# Altium project Ocore.PrjPcb
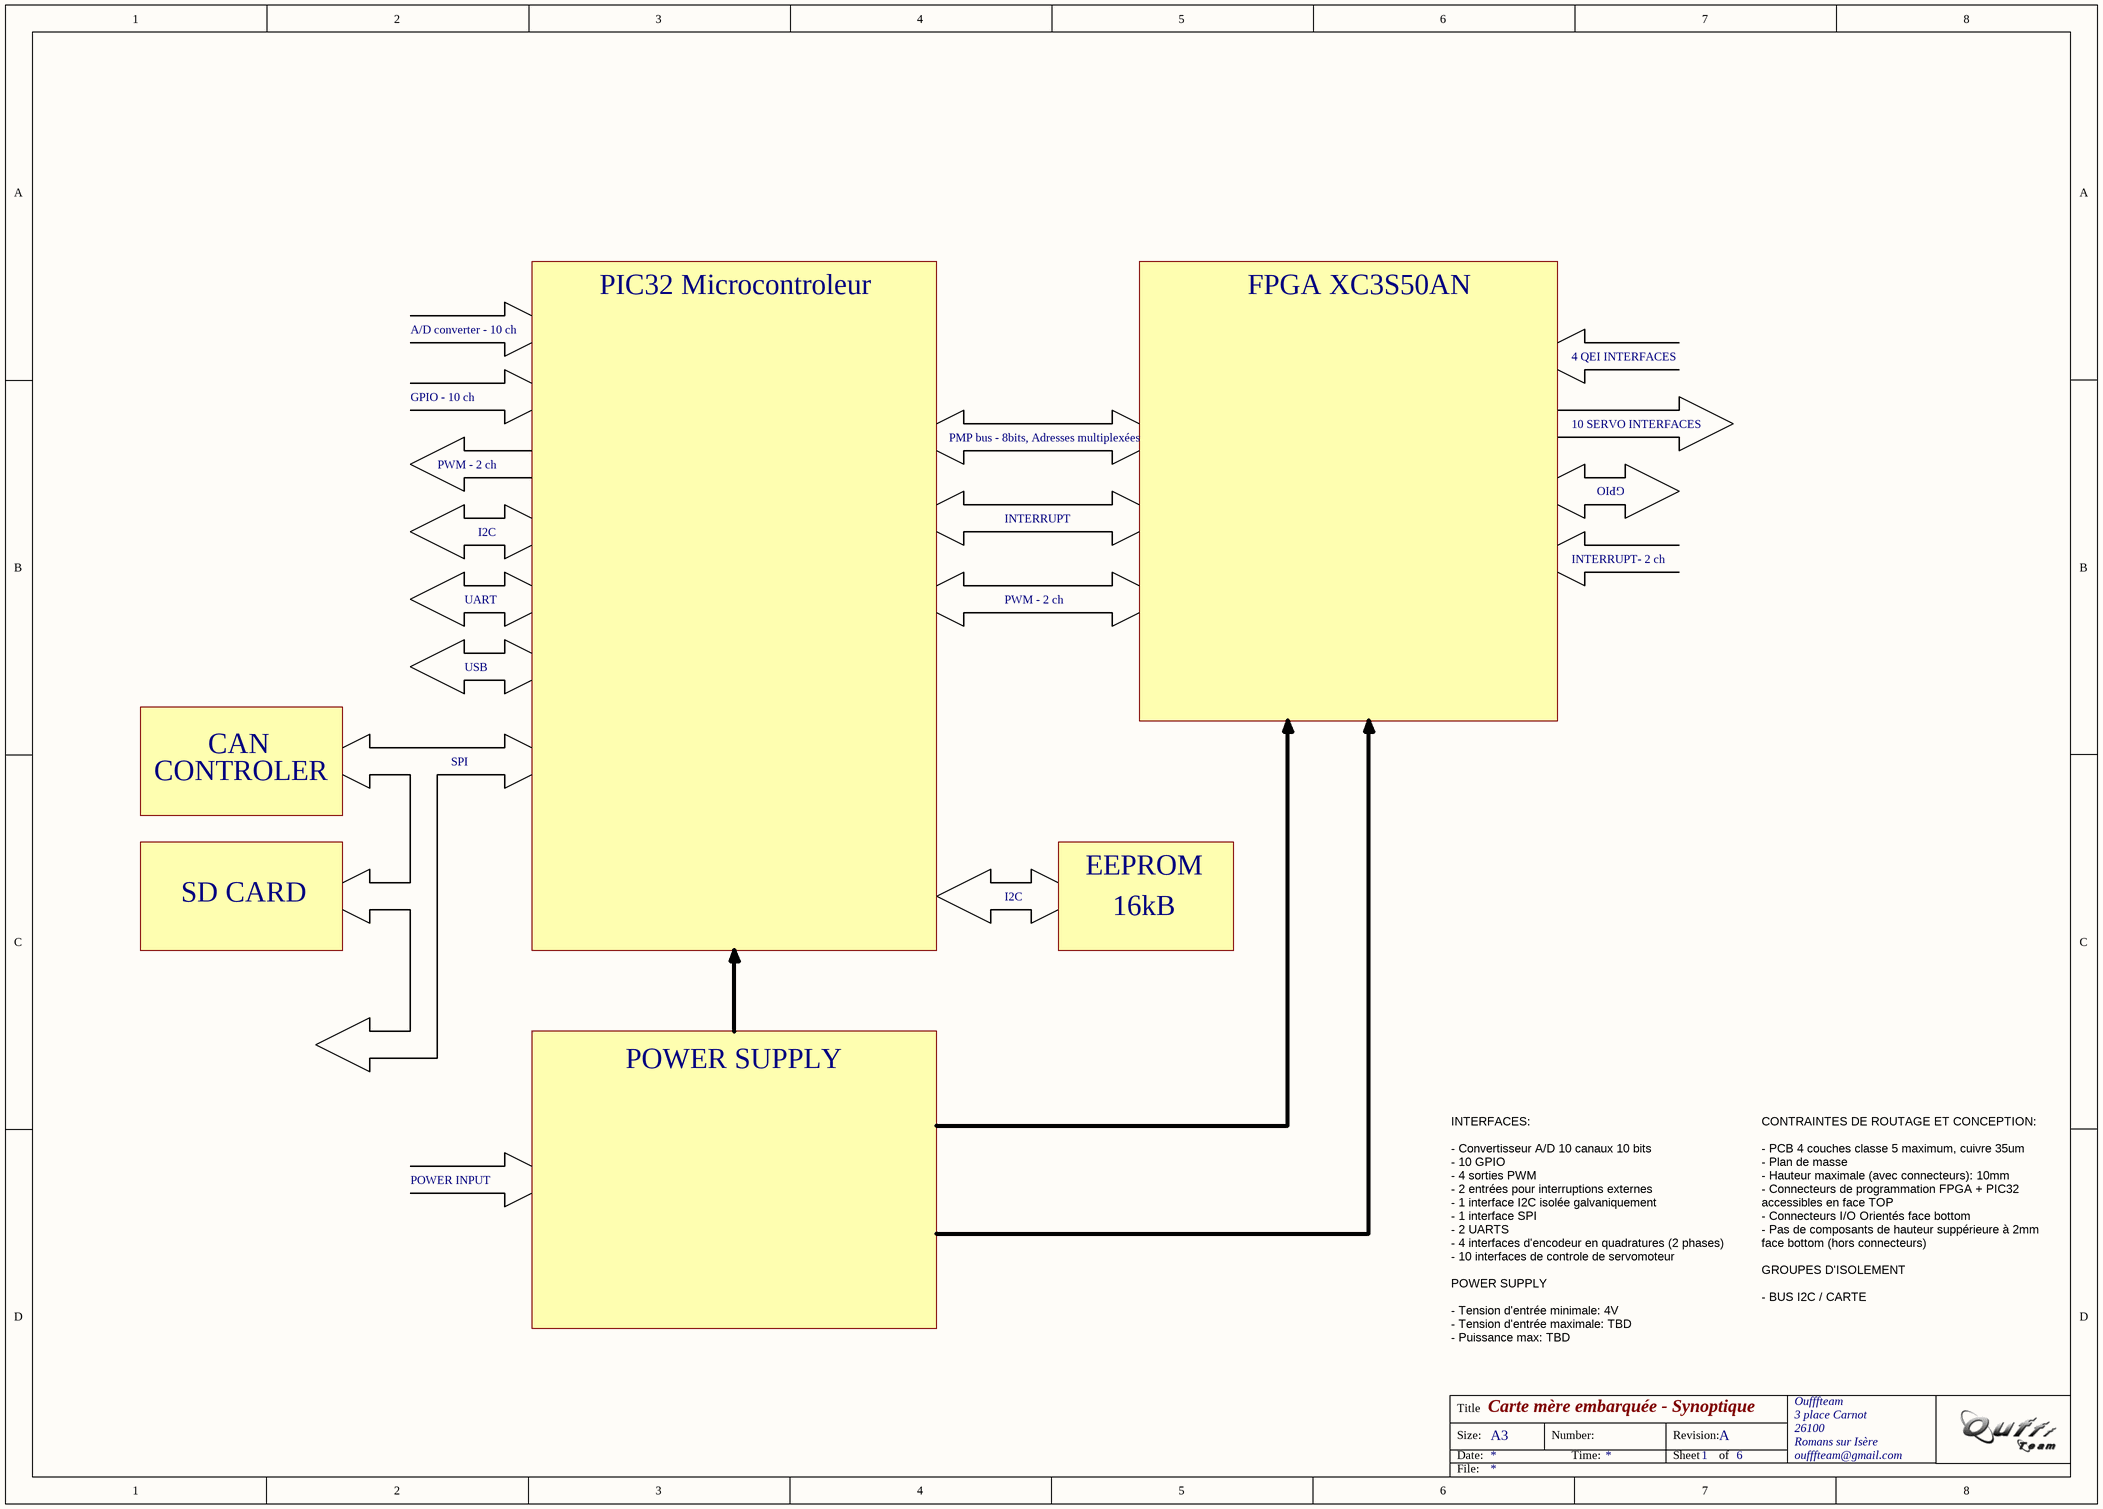
[diagram p0: SYNOPTIQUE.SchDoc]
4 sheets, 90 parts. Net scope: global (net labels, ports and power ports of the same name join across sheets).
Board files: o_core_v1.PcbDoc, o_core_v2.PcbDoc, o_core_v3.PcbDoc
Sheets:
  SYNOPTIQUE.SchDoc
  CONNECTS.SchDoc
  FPGA.SchDoc
  POWER_SUPPLY.SchDoc

## Sheet SYNOPTIQUE.SchDoc: Carte mère embarquée - Synoptique
size A3; Author: B Labbe; CompanyName: Ouffteam; DrawnBy: B Labbe; Engineer: B Labbe; Organization: Ouffteam; Address1: L3, 12a Rodborough Rd; Address2: Frenchs Forest; Address3: NSW; Address4: Australia 2086; Revision: A; SheetNumber: 1; SheetTotal: 6; DocumentName: Carte mère embarquée - Synoptique

### Notes on the sheet
- PIC32 Microcontroleur
- FPGA XC3S50AN
- A/D converter - 10 ch
- 4 QEI INTERFACES
- GPIO - 10 ch
- PMP bus - 8bits, Adresses multiplexées
- 10 SERVO INTERFACES
- PWM - 2 ch
- INTERRUPT
- GPIO
- I2C
- INTERRUPT- 2 ch
- UART
- USB
- CONTROLER
- CAN
- SPI
- SD CARD
- EEPROM
- 16kB
- POWER SUPPLY
- POWER INPUT
- INTERFACES:
  - Convertisseur A/D 10 canaux 10 bits
  - 10 GPIO
  - 4 sorties PWM
  - 2 entrées pour interruptions externes
  - 1 interface I2C isolée galvaniquement
  - 1 interface SPI
  - 2 UARTS
  - 4 interfaces d'encodeur en quadratures (2 phases)
  - 10 interfaces de controle de servomoteur
  POWER SUPPLY
  - Tension d'entrée minimale: 4V
  - Tension d'entrée maximale: TBD
  - Puissance max: TBD
- CONTRAINTES DE ROUTAGE ET CONCEPTION:
  - PCB 4 couches classe 5 maximum, cuivre 35um
  - Plan de masse
  - Hauteur maximale (avec connecteurs): 10mm
  - Connecteurs de programmation FPGA + PIC32 accessibles en face TOP
  - Connecteurs I/O Orientés face bottom
  - Pas de composants de hauteur suppérieure à 2mm face bottom (hors connecteurs)
  GROUPES D'ISOLEMENT
  - BUS I2C / CARTE
- Title
- Size:
- Date:
- A3
- Number:
- Time:
- Revision:
- Sheet
- of
- Oufffteam
- 3 place Carnot
- 26100
- Romans sur Isère
- oufffteam@gmail.com
- File:

## Sheet CONNECTS.SchDoc: Carte mère embarquée - Ports
size A3; Author: B.Labbe; CompanyName: Oufffteam; DrawnBy: B.Labbe; Engineer: B.Labbe; Organization: Oufffteam; Revision: A; SheetNumber: 2; SheetTotal: 6; DocumentName: Carte mère embarquée - Ports
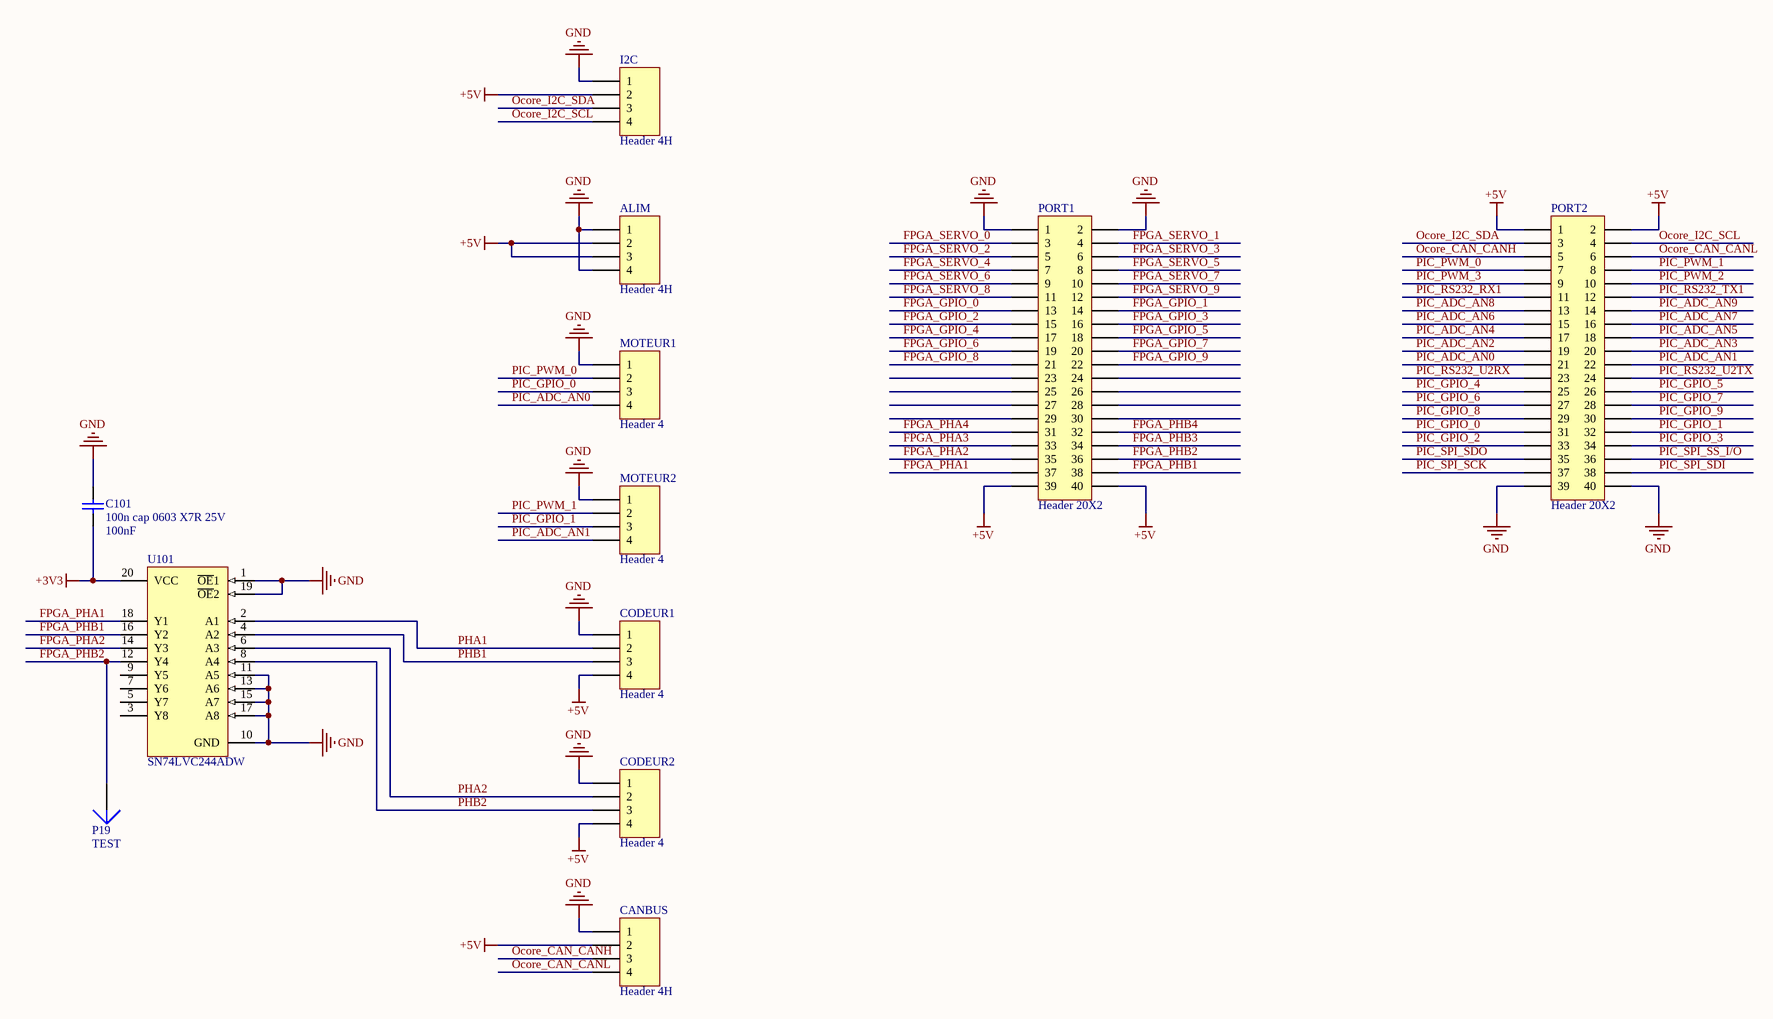
[diagram p1: CONNECTS.SchDoc]

### Parts
ALIM  Header 4H  [HDR1X4H]
C101  100n cap 0603 X7R 25V  value 100nF  [1608[0603]]  (graphical)
CANBUS  Header 4H  [HDR1X4H]
CODEUR1  Header 4  [HDR1X4]  (graphical)
CODEUR2  Header 4  [HDR1X4]  (graphical)
I2C  Header 4H  [HDR1X4H]
MOTEUR1  Header 4  [HDR1X4]  (graphical)
MOTEUR2  Header 4  [HDR1X4]  (graphical)
P19  TEST  [TP1]  (graphical)
PORT1  Header 20X2  [HDR2X20]
PORT2  Header 20X2  [HDR2X20]
U101  SN74LVC244ADW  [DW020_N]  (graphical)

### Nets
+3V3: C101.1 U101.20(VCC)
+5V: ALIM.2 ALIM.3 CANBUS.2 CODEUR1.4 CODEUR2.4 I2C.2 PORT1.39 PORT1.40 PORT2.1 PORT2.2
GND: ALIM.1 ALIM.4 C101.2 CANBUS.1 CODEUR1.1 CODEUR2.1 I2C.1 MOTEUR1.1 MOTEUR2.1 PORT1.1 PORT1.2 PORT2.39 PORT2.40 U101.1(~{OE}1) U101.10(GND) U101.11(A5) U101.13(A6) U101.15(A7) U101.17(A8) U101.19(~{OE}2)
FPGA_GPIO_0: PORT1.13
FPGA_GPIO_1: PORT1.14
FPGA_GPIO_2: PORT1.15
FPGA_GPIO_3: PORT1.16
FPGA_GPIO_4: PORT1.17
FPGA_GPIO_5: PORT1.18
FPGA_GPIO_6: PORT1.19
FPGA_GPIO_7: PORT1.20
FPGA_GPIO_8: PORT1.21
FPGA_GPIO_9: PORT1.22
FPGA_PHA1: PORT1.37 U101.18(Y1)
FPGA_PHA2: PORT1.35 U101.14(Y3)
FPGA_PHA3: PORT1.33
FPGA_PHA4: PORT1.31
FPGA_PHB1: PORT1.38 U101.16(Y2)
FPGA_PHB2: P19.1 PORT1.36 U101.12(Y4)
FPGA_PHB3: PORT1.34
FPGA_PHB4: PORT1.32
FPGA_SERVO_0: PORT1.3
FPGA_SERVO_1: PORT1.4
FPGA_SERVO_2: PORT1.5
FPGA_SERVO_3: PORT1.6
FPGA_SERVO_4: PORT1.7
FPGA_SERVO_5: PORT1.8
FPGA_SERVO_6: PORT1.9
FPGA_SERVO_7: PORT1.10
FPGA_SERVO_8: PORT1.11
FPGA_SERVO_9: PORT1.12
Ocore_CAN_CANH: CANBUS.3 PORT2.5
Ocore_CAN_CANL: CANBUS.4 PORT2.6
Ocore_I2C_SCL: I2C.4 PORT2.4
Ocore_I2C_SDA: I2C.3 PORT2.3
PHA1: CODEUR1.2 U101.2(A1)
PHA2: CODEUR2.2 U101.6(A3)
PHB1: CODEUR1.3 U101.4(A2)
PHB2: CODEUR2.3 U101.8(A4)
PIC_ADC_AN0: MOTEUR1.4 PORT2.21
PIC_ADC_AN1: MOTEUR2.4 PORT2.22
PIC_ADC_AN2: PORT2.19
PIC_ADC_AN3: PORT2.20
PIC_ADC_AN4: PORT2.17
PIC_ADC_AN5: PORT2.18
PIC_ADC_AN6: PORT2.15
PIC_ADC_AN7: PORT2.16
PIC_ADC_AN8: PORT2.13
PIC_ADC_AN9: PORT2.14
PIC_GPIO_0: MOTEUR1.3 PORT2.31
PIC_GPIO_1: MOTEUR2.3 PORT2.32
PIC_GPIO_2: PORT2.33
PIC_GPIO_3: PORT2.34
PIC_GPIO_4: PORT2.25
PIC_GPIO_5: PORT2.26
PIC_GPIO_6: PORT2.27
PIC_GPIO_7: PORT2.28
PIC_GPIO_8: PORT2.29
PIC_GPIO_9: PORT2.30
PIC_PWM_0: MOTEUR1.2 PORT2.7
PIC_PWM_1: MOTEUR2.2 PORT2.8
PIC_PWM_2: PORT2.10
PIC_PWM_3: PORT2.9
PIC_RS232_RX1: PORT2.11
PIC_RS232_TX1: PORT2.12
PIC_RS232_U2RX: PORT2.23
PIC_RS232_U2TX: PORT2.24
PIC_SPI_SCK: PORT2.37
PIC_SPI_SDI: PORT2.38
PIC_SPI_SDO: PORT2.35
PIC_SPI_SS_I/O: PORT2.36

Not connected (* = marked no-connect by the designer): PORT1 23 24 25 26 27 28 29 30; U101 3(Y8) 5(Y7) 7(Y6) 9(Y5)

### Notes on the sheet
- Title
- Size:
- Date:
- A3
- Number:
- Time:
- Revision:
- Sheet
- of
- Oufffteam
- 3 place Carnot
- 26100
- Romans sur Isère
- oufffteam@gmail.com
- File:

### Library data of the parts
ALIM CANBUS I2C = Header 4H: Header, 4-Pin, Right Angle; LatestRevisionDate: 17-Jul-2002; LatestRevisionNote: Re-released for DXP Platform.; Publisher: Altium Limited
C101 = Cap: Capacitor; Published: 8-Jun-2000; LatestRevisionDate: 17-Jul-2002; LatestRevisionNote: Re-released for DXP Platform.; PackageReference: RAD-0.3; Publisher: Altium Limited
CODEUR1 CODEUR2 MOTEUR1 MOTEUR2 = Header 4: Header, 4-Pin; LatestRevisionDate: 17-Jul-2002; LatestRevisionNote: Re-released for DXP Platform.; Publisher: Altium Limited
P19 = Plug: LatestRevisionDate: 17-Jul-2002; LatestRevisionNote: Re-released for DXP Platform.; Publisher: Altium Limited
PORT1 PORT2 = Header 20X2: Header, 20-Pin, Dual row; LatestRevisionDate: 17-Jul-2002; LatestRevisionNote: Re-released for DXP Platform.; Publisher: Altium Limited
U101 = SN74LVC244ADW: Octal Buffer/Driver with 3-State Outputs; Published: 8-Jun-2000; LatestRevisionDate: 13-Apr-2006; LatestRevisionNote: IPC-7351 Footprint Added.; DatasheetVersion: Apr-1999; PackageVersion: Mar-2000; PackageReference: DW020; Publisher: Altium Limited; PackageDescription: 20-Pin Plastic Small Outline Integrated Circuit 1.27 mm Pitch; Code_JEDEC: MS-013; Code_IPC: SOIC127P1030-20; ComponentLink1Description: Manufacturer Link; ComponentLink1URL: http://www.ti.com/; ComponentLink2Description: Datasheet; ComponentLink2URL: http://www-s.ti.com/sc/ds/sn74lvc244a.pdf

## Sheet FPGA.SchDoc: Carte mère embarquée - CPLD
size A3; Author: B Labbe; CompanyName: Oufffteam; DrawnBy: B Labbe; Engineer: B Labbe; Organization: Oufffteam; Address1: L3, 12a Rodborough Rd; Address2: Frenchs Forest; Address3: NSW; Address4: Australia 2086; Revision: A; SheetNumber: 4; SheetTotal: 6; DocumentName: Carte mère embarquée - CPLD
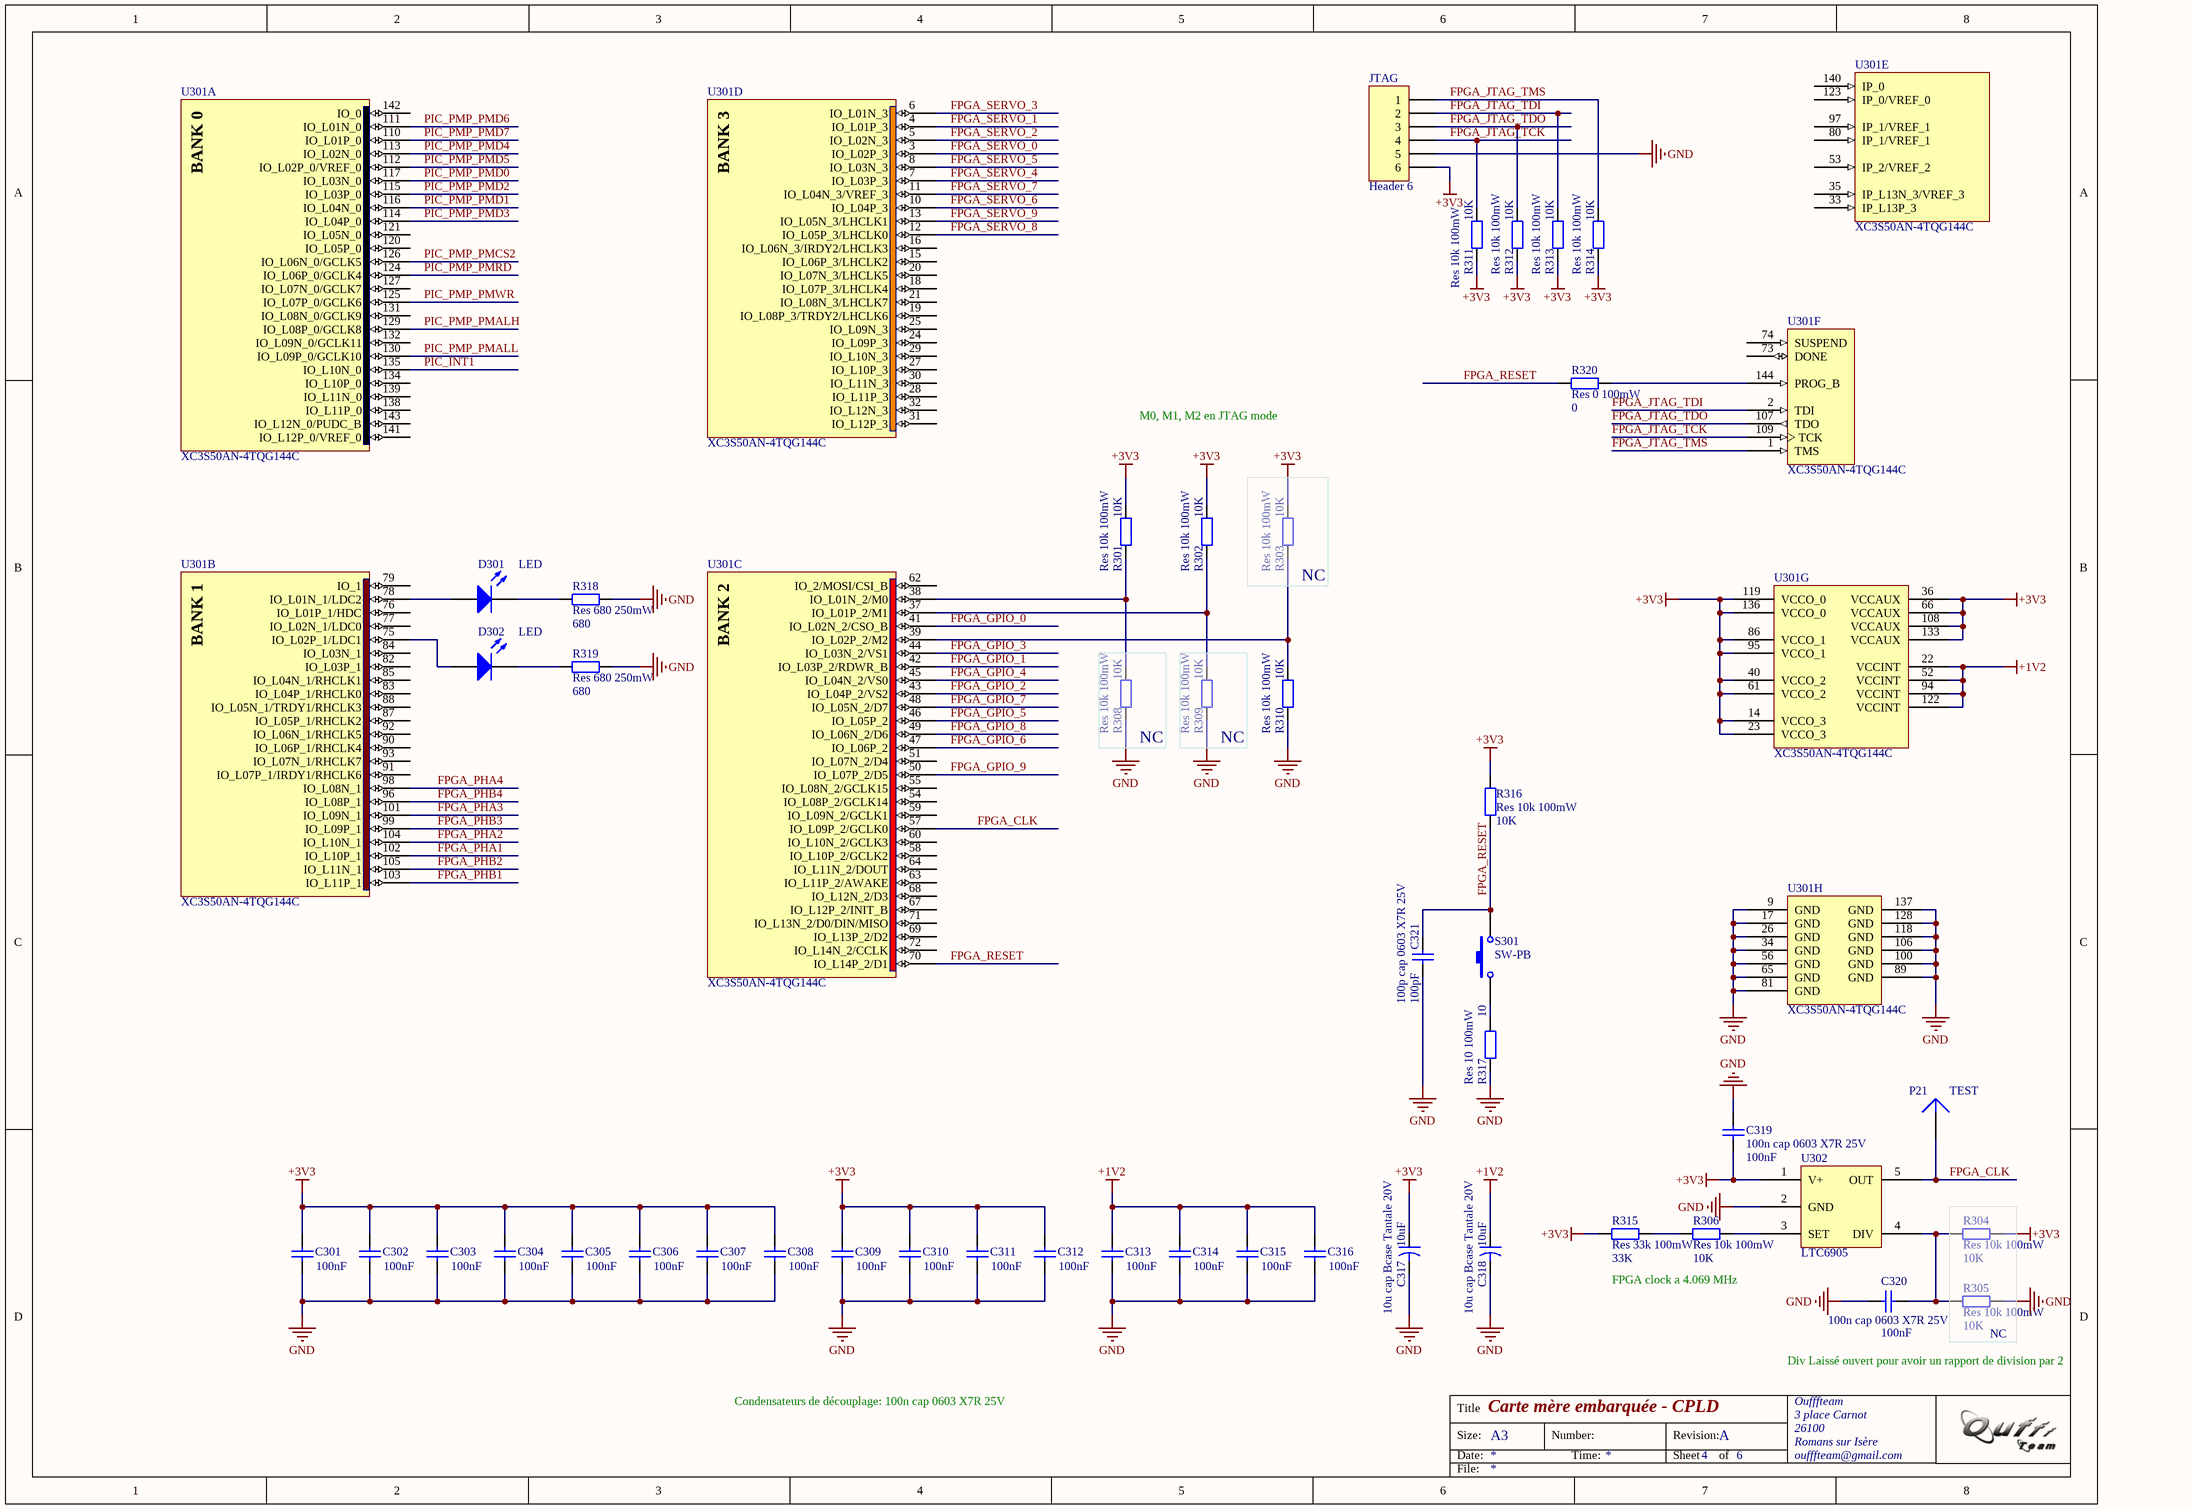
[diagram p2: FPGA.SchDoc]

### Parts
C301  value 100nF  [1608[0603]]  (hidden comment: 100n cap 0603 X7R 25V)
C302  value 100nF  [1608[0603]]  (hidden comment: 100n cap 0603 X7R 25V)
C303  value 100nF  [1608[0603]]  (hidden comment: 100n cap 0603 X7R 25V)
C304  value 100nF  [1608[0603]]  (hidden comment: 100n cap 0603 X7R 25V)
C305  value 100nF  [1608[0603]]  (hidden comment: 100n cap 0603 X7R 25V)
C306  value 100nF  [1608[0603]]  (hidden comment: 100n cap 0603 X7R 25V)
C307  value 100nF  [1608[0603]]  (hidden comment: 100n cap 0603 X7R 25V)
C308  value 100nF  [1608[0603]]  (hidden comment: 100n cap 0603 X7R 25V)
C309  value 100nF  [1608[0603]]  (hidden comment: 100n cap 0603 X7R 25V)
C310  value 100nF  [1608[0603]]  (hidden comment: 100n cap 0603 X7R 25V)
C311  value 100nF  [1608[0603]]  (hidden comment: 100n cap 0603 X7R 25V)
C312  value 100nF  [1608[0603]]  (hidden comment: 100n cap 0603 X7R 25V)
C313  value 100nF  [1608[0603]]  (hidden comment: 100n cap 0603 X7R 25V)
C314  value 100nF  [1608[0603]]  (hidden comment: 100n cap 0603 X7R 25V)
C315  value 100nF  [1608[0603]]  (hidden comment: 100n cap 0603 X7R 25V)
C316  value 100nF  [1608[0603]]  (hidden comment: 100n cap 0603 X7R 25V)
C317  10u cap Bcase Tantale 20V  value 10uF  [6032]
C318  10u cap Bcase Tantale 20V  value 10uF  [6032]
C319  100n cap 0603 X7R 25V  value 100nF  [1608[0603]]
C320  100n cap 0603 X7R 25V  value 100nF  [1608[0603]]
C321  100p cap 0603 X7R 25V  value 100pF  [1608[0603]]
D301  LED  [1608[0603]]
D302  LED  [1608[0603]]
JTAG  Header 6  [HDR1X6]
P21  TEST  [TP1]
R301  Res 10k 100mW  value 10K  [1608[0603]]
R302  Res 10k 100mW  value 10K  [1608[0603]]
R303  Res 10k 100mW  value 10K  [1608[0603]]
R304  Res 10k 100mW  value 10K  [1608[0603]]
R305  Res 10k 100mW  value 10K  [1608[0603]]
R306  Res 10k 100mW  value 10K  [1608[0603]]
R308  Res 10k 100mW  value 10K  [1608[0603]]
R309  Res 10k 100mW  value 10K  [1608[0603]]
R310  Res 10k 100mW  value 10K  [1608[0603]]
R311  Res 10k 100mW  value 10K  [1608[0603]]
R312  Res 10k 100mW  value 10K  [1608[0603]]
R313  Res 10k 100mW  value 10K  [1608[0603]]
R314  Res 10k 100mW  value 10K  [1608[0603]]
R315  Res 33k 100mW  value 33K  [1608[0603]]
R316  Res 10k 100mW  value 10K  [1608[0603]]
R317  Res 10 100mW  value 10  [1608[0603]]
R318  Res 680 250mW  value 680  [1608[0603]]
R319  Res 680 250mW  value 680  [1608[0603]]
R320  Res 0 100mW  value 0  [1608[0603]]
S301  SW-PB  [BP1]
U301  XC3S50AN-4TQG144C  [TQG144_N]  (parts A,B,C,D,E,F,G,H of 8)
U302  LTC6905  [S5]

### Blocks framed on the sheet
NC: R303
NC: R308
NC: R309
NC: R304 R305

### Nets
+1V2: C313.2 C314.2 C315.2 C316.2 C318.1 U301.22(VCCINT) U301.52(VCCINT) U301.94(VCCINT) U301.122(VCCINT)
+3V3: C301.2 C302.2 C303.2 C304.2 C305.2 C306.2 C307.2 C308.2 C309.2 C310.2 C311.2 C312.2 C317.1 C319.1 JTAG.6 R301.2 R302.2 R303.2 R304.2 R311.1 R312.1 R313.1 R314.1 R315.1 R316.2 U301.14(VCCO_3) U301.23(VCCO_3) U301.36(VCCAUX) U301.40(VCCO_2) U301.61(VCCO_2) U301.66(VCCAUX) U301.86(VCCO_1) U301.95(VCCO_1) U301.108(VCCAUX) U301.119(VCCO_0) U301.133(VCCAUX) U301.136(VCCO_0) U302.1(V+)
GND: C301.1 C302.1 C303.1 C304.1 C305.1 C306.1 C307.1 C308.1 C309.1 C310.1 C311.1 C312.1 C313.1 C314.1 C315.1 C316.1 C317.2 C318.2 C319.2 C320.1 C321.1 JTAG.5 R305.2 R308.1 R309.1 R310.1 R317.1 R318.2 R319.2 U301.9(GND) U301.17(GND) U301.26(GND) U301.34(GND) U301.56(GND) U301.65(GND) U301.81(GND) U301.89(GND) U301.100(GND) U301.106(GND) U301.118(GND) U301.128(GND) U301.137(GND) U302.2(GND)
FPGA_CLK: P21.1 U301.57(IO_L09P_2/GCLK0) U302.5(OUT)
FPGA_GPIO_0: U301.41(IO_L02N_2/CSO_B)
FPGA_GPIO_1: U301.42(IO_L03P_2/RDWR_B)
FPGA_GPIO_2: U301.43(IO_L04P_2/VS2)
FPGA_GPIO_3: U301.44(IO_L03N_2/VS1)
FPGA_GPIO_4: U301.45(IO_L04N_2/VS0)
FPGA_GPIO_5: U301.46(IO_L05P_2)
FPGA_GPIO_6: U301.47(IO_L06P_2)
FPGA_GPIO_7: U301.48(IO_L05N_2/D7)
FPGA_GPIO_8: U301.49(IO_L06N_2/D6)
FPGA_GPIO_9: U301.50(IO_L07P_2/D5)
FPGA_JTAG_TCK: JTAG.4 R311.2 U301.109(TCK)
FPGA_JTAG_TDI: JTAG.2 R313.2 U301.2(TDI)
FPGA_JTAG_TDO: JTAG.3 R312.2 U301.107(TDO)
FPGA_JTAG_TMS: JTAG.1 R314.2 U301.1(TMS)
FPGA_PHA1: U301.102(IO_L10P_1)
FPGA_PHA2: U301.104(IO_L10N_1)
FPGA_PHA3: U301.101(IO_L09N_1)
FPGA_PHA4: U301.98(IO_L08N_1)
FPGA_PHB1: U301.103(IO_L11P_1)
FPGA_PHB2: U301.105(IO_L11N_1)
FPGA_PHB3: U301.99(IO_L09P_1)
FPGA_PHB4: U301.96(IO_L08P_1)
FPGA_RESET: C321.2 R316.1 R320.1 S301.3 U301.70(IO_L14P_2/D1)
FPGA_SERVO_0: U301.3(IO_L02P_3)
FPGA_SERVO_1: U301.4(IO_L01P_3)
FPGA_SERVO_2: U301.5(IO_L02N_3)
FPGA_SERVO_3: U301.6(IO_L01N_3)
FPGA_SERVO_4: U301.7(IO_L03P_3)
FPGA_SERVO_5: U301.8(IO_L03N_3)
FPGA_SERVO_6: U301.10(IO_L04P_3)
FPGA_SERVO_7: U301.11(IO_L04N_3/VREF_3)
FPGA_SERVO_8: U301.12(IO_L05P_3/LHCLK0)
FPGA_SERVO_9: U301.13(IO_L05N_3/LHCLK1)
PIC_INT1: U301.135(IO_L10N_0)
PIC_PMP_PMALH: U301.129(IO_L08P_0/GCLK8)
PIC_PMP_PMALL: U301.130(IO_L09P_0/GCLK10)
PIC_PMP_PMCS2: U301.126(IO_L06N_0/GCLK5)
PIC_PMP_PMD0: U301.117(IO_L03N_0)
PIC_PMP_PMD1: U301.116(IO_L04N_0)
PIC_PMP_PMD2: U301.115(IO_L03P_0)
PIC_PMP_PMD3: U301.114(IO_L04P_0)
PIC_PMP_PMD4: U301.113(IO_L02N_0)
PIC_PMP_PMD5: U301.112(IO_L02P_0/VREF_0)
PIC_PMP_PMD6: U301.111(IO_L01N_0)
PIC_PMP_PMD7: U301.110(IO_L01P_0)
PIC_PMP_PMRD: U301.124(IO_L06P_0/GCLK4)
PIC_PMP_PMWR: U301.125(IO_L07P_0/GCLK6)
NetC320_2: C320.2 R304.1 R305.1 U302.4(DIV)
NetD301_1: D301.1(A) U301.78(IO_L01N_1/LDC2)
NetD301_2: D301.2(K) R318.1
NetD302_1: D302.1(A) U301.75(IO_L02P_1/LDC1)
NetD302_2: D302.2(K) R319.1
NetR301_1: R301.1 R308.2 U301.38(IO_L01N_2/M0)
NetR302_1: R302.1 R309.2 U301.37(IO_L01P_2/M1)
NetR303_1: R303.1 R310.2 U301.39(IO_L02P_2/M2)
NetR306_1: R306.1 R315.2
NetR306_2: R306.2 U302.3(SET)
NetR317_2: R317.2 S301.1
NetR320_2: R320.2 U301.144(PROG_B)

Not connected (* = marked no-connect by the designer): U301 15(IO_L06P_3/LHCLK2) 16(IO_L06N_3/IRDY2/LHCLK3) 18(IO_L07P_3/LHCLK4) 19(IO_L08P_3/TRDY2/LHCLK6) 20(IO_L07N_3/LHCLK5) 21(IO_L08N_3/LHCLK7) 24(IO_L09P_3) 25(IO_L09N_3) 27(IO_L10P_3) 28(IO_L11P_3) 29(IO_L10N_3) 30(IO_L11N_3) 31(IO_L12P_3) 32(IO_L12N_3) 33(IP_L13P_3) 35(IP_L13N_3/VREF_3) 51(IO_L07N_2/D4) 53(IP_2/VREF_2) 54(IO_L08P_2/GCLK14) 55(IO_L08N_2/GCLK15) 58(IO_L10P_2/GCLK2) 59(IO_L09N_2/GCLK1) 60(IO_L10N_2/GCLK3) 62(IO_2/MOSI/CSI_B) 63(IO_L11P_2/AWAKE) 64(IO_L11N_2/DOUT) 67(IO_L12P_2/INIT_B) 68(IO_L12N_2/D3) 69(IO_L13P_2/D2) 71(IO_L13N_2/D0/DIN/MISO) 72(IO_L14N_2/CCLK) 73(DONE) 74(SUSPEND) 76(IO_L01P_1/HDC) 77(IO_L02N_1/LDC0) 79(IO_1) 80(IP_1/VREF_1) 82(IO_L03P_1) 83(IO_L04P_1/RHCLK0) 84(IO_L03N_1) 85(IO_L04N_1/RHCLK1) 87(IO_L05P_1/RHCLK2) 88(IO_L05N_1/TRDY1/RHCLK3) 90(IO_L06P_1/RHCLK4) 91(IO_L07P_1/IRDY1/RHCLK6) 92(IO_L06N_1/RHCLK5) 93(IO_L07N_1/RHCLK7) 97(IP_1/VREF_1) 120(IO_L05P_0) 121(IO_L05N_0) 123(IP_0/VREF_0) 127(IO_L07N_0/GCLK7) 131(IO_L08N_0/GCLK9) 132(IO_L09N_0/GCLK11) 134(IO_L10P_0) 138(IO_L11P_0) 139(IO_L11N_0) 140(IP_0) 141(IO_L12P_0/VREF_0) 142(IO_0) 143(IO_L12N_0/PUDC_B)

### Notes on the sheet
- M0, M1, M2 en JTAG mode
- FPGA clock a 4.069 MHz
- Div Laissé ouvert pour avoir un rapport de division par 2
- Condensateurs de découplage: 100n cap 0603 X7R 25V
- Title
- Size:
- Date:
- A3
- Number:
- Time:
- Revision:
- Sheet
- of
- Oufffteam
- 3 place Carnot
- 26100
- Romans sur Isère
- oufffteam@gmail.com
- File:
- (in symbol XC3S50AN-4TQG144C, part A) BANK 0
- (in symbol XC3S50AN-4TQG144C, part B) BANK 1
- (in symbol XC3S50AN-4TQG144C, part C) BANK 2
- (in symbol XC3S50AN-4TQG144C, part D) BANK 3

### Library data of the parts
C301-C316 C319-C321 = Cap: Capacitor; Published: 8-Jun-2000; LatestRevisionDate: 17-Jul-2002; LatestRevisionNote: Re-released for DXP Platform.; PackageReference: RAD-0.3; Publisher: Altium Limited
C317 C318 = Cap2: Capacitor; Published: 23-Sep-2002; PackageReference: CAPR5-4X5; Publisher: Altium Limited
D301 D302 = LED0: LED SML-311DTT86; Published: 8-Jun-2000; LatestRevisionDate: 08-Jul-2005; LatestRevisionNote: Mech Layer 1 removed.; PackageReference: LED-0; Publisher: Altium Limited
JTAG = Header 6: Header, 6-Pin; LatestRevisionDate: 17-Jul-2002; LatestRevisionNote: Re-released for DXP Platform.; Publisher: Altium Limited
P21 = Plug: LatestRevisionDate: 17-Jul-2002; LatestRevisionNote: Re-released for DXP Platform.; Publisher: Altium Limited
R301-R306 R308-R320 = Res2: Resistor; Published: 8-Jun-2000; LatestRevisionDate: 17-Jul-2002; LatestRevisionNote: Re-released for DXP Platform.; PackageReference: AXIAL-0.4; Publisher: Altium Limited
S301 = SW-PB: Switch; Published: 24-Mar-1999; LatestRevisionDate: 17-Jul-2002; LatestRevisionNote: Re-released for DXP Platform.; PackageReference: SPST-2; Publisher: Altium Limited
U301 = XC3S50AN-4TQG144C: Spartan-3AN Non-Volatile FPGA, 108 User I/Os, 144-Pin TQFP, Standard Performance, Commercial Grade, Pb-Free; Published: 20-Jul-2007; DatasheetVersion: 26-Feb-2007; PackageVersion: ver1.2, Jun-2004; PackageReference: TQG144; Publisher: Altium Limited; PackageDescription: 144-Pin Thin Quad Flat Pack (TQG144) - Pb-Free; Code_JEDEC: MS-026-BFB; ComponentLink1Description: Manufacturer Link; ComponentLink1URL: http://www.xilinx.com/products/silicon_solutions/fpgas/spartan_series/spartan3an_fpgas/index.htm; ComponentLink2Description: Datasheet; ComponentLink2URL: http://direct.xilinx.com/bvdocs/publications/ds557.pdf
U302 = LTC6905: 17MHz to 170MHz Resistor Set SOT-23 Oscillator

## Sheet POWER_SUPPLY.SchDoc: Carte mère embarquée - Power Supply
size A3; Author: B Labbe; CompanyName: Oufffteam; DrawnBy: B Labbe; Engineer: B Labbe; Organization: Oufffteam; Address1: L3, 12a Rodborough Rd; Address2: Frenchs Forest; Address3: NSW; Address4: Australia 2086; Revision: A; SheetNumber: 5; SheetTotal: 6; DocumentName: Carte mère embarquée - Power Supply
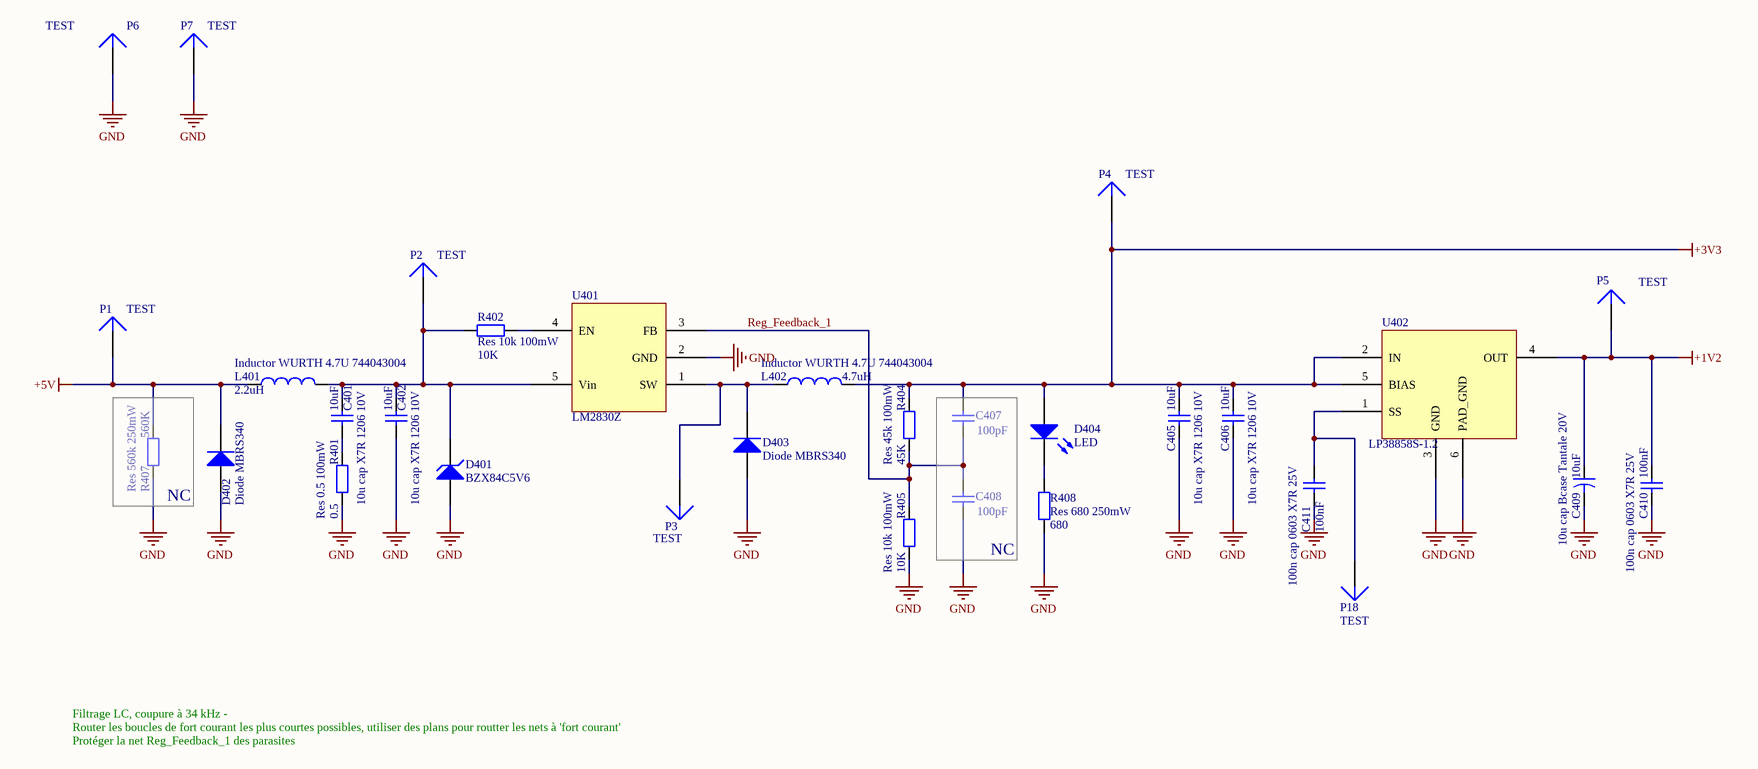
[diagram p3: POWER_SUPPLY.SchDoc]

### Parts
C401  10u cap X7R 1206 10V  value 10uF  [3216[1206]]
C402  10u cap X7R 1206 10V  value 10uF  [3216[1206]]
C405  10u cap X7R 1206 10V  value 10uF  [3216[1206]]
C406  10u cap X7R 1206 10V  value 10uF  [3216[1206]]
C407  value 100pF  [1608[0603]]  (hidden comment: 100p cap 0603 X7R 25V)
C408  value 100pF  [1608[0603]]  (hidden comment: 100p cap 0603 X7R 25V)
C409  10u cap Bcase Tantale 20V  value 10uF  [6032]
C410  100n cap 0603 X7R 25V  value 100nF  [1608[0603]]
C411  100n cap 0603 X7R 25V  value 100nF  [1608[0603]]
D401  BZX84C5V6  [318-07]
D402  Diode MBRS340  [SMC]
D403  Diode MBRS340  [SMC]
D404  LED  [1608[0603]]
L401  Inductor WURTH 4.7U 744043004  value 2.2uH  [744043004]
L402  Inductor WURTH 4.7U 744043004  value 4.7uH  [744043004]
P1  TEST  [TP1]
P2  TEST  [TP1]
P3  TEST  [TP1]
P4  TEST  [TP1]
P5  TEST  [TP1]
P6  TEST  [PIN1]
P7  TEST  [PIN1]
P18  TEST  [TP1]
R401  Res 0.5 100mW  value 0.5  [1608[0603]]
R402  Res 10k 100mW  value 10K  [1608[0603]]
R404  Res 45k 100mW  value 45K  [1608[0603]]
R405  Res 10k 100mW  value 10K  [1608[0603]]
R407  Res 560k 250mW  value 560K  [3216[1206]]
R408  Res 680 250mW  value 680  [1608[0603]]
U401  LM2830Z  [DBV005]
U402  LP38858S-1.2  [TO263-5Lead]

### Blocks framed on the sheet
NC: R407
NC: C407 C408

### Nets
+1V2: C409.1 C410.2 P5.1 U402.4(OUT)
+3V3: C405.2 C406.2 C407.2 D404.1(A) L402.2 P4.1 R404.2 U402.2(IN) U402.5(BIAS)
+5V: D402.2(K) L401.1 P1.1 R407.2
GND: C402.1 C405.1 C406.1 C408.1 C409.2 C410.1 C411.1 D401.1(A) D402.1(A) D403.1(A) P6.1 P7.1 R401.1 R405.1 R407.1 R408.1 U401.2(GND) U402.3(GND) U402.6(PAD_GND)
Reg_Feedback_1: C407.1 C408.2 R404.1 R405.2 U401.3(FB)
NetC401_1: C401.1 R401.2
NetC401_2: C401.2 C402.2 D401.3(K) L401.2 P2.1 R402.1 U401.5(Vin)
NetC411_2: C411.2 P18.1 U402.1(SS)
NetD403_2: D403.2(K) L402.1 P3.1 U401.1(SW)
NetD404_2: D404.2(K) R408.2
NetR402_2: R402.2 U401.4(EN)

### Notes on the sheet
- Router les boucles de fort courant les plus courtes possibles, utiliser des plans pour routter les nets à 'fort courant'
- Protéger la net Reg_Feedback_1 des parasites
- Filtrage LC, coupure à 34 kHz -
- Title
- Size:
- Date:
- A3
- Number:
- Time:
- Revision:
- Sheet
- of
- Oufffteam
- 3 place Carnot
- 26100
- Romans sur Isère
- oufffteam@gmail.com
- File:

### Library data of the parts
C401 C402 C405-C408 C410 C411 = Cap: Capacitor; Published: 8-Jun-2000; LatestRevisionDate: 17-Jul-2002; LatestRevisionNote: Re-released for DXP Platform.; PackageReference: RAD-0.3; Publisher: Altium Limited
C409 = Cap2: Capacitor; Published: 23-Sep-2002; PackageReference: CAPR5-4X5; Publisher: Altium Limited
D401 = BZX84C5V6LT1: Zener Voltage Regulator Diode; Note: Pin 2 is not connected and not drawn.; Published: 29-Sep-2000; LatestRevisionDate: 17-Jul-2002; LatestRevisionNote: Re-released for DXP Platform.; PackageReference: 318-07; Publisher: Altium Limited; PackageDescription: SOT-23; 3 Leads; Body 3.0 x 2.5 mm, inc. leads (LxW max); ComponentLink1Description: Manufacturer Link; ComponentLink1URL: http://www.onsemi.com/site/products/landing?taxonomyID=194; ComponentLink2Description: Datasheet; ComponentLink2URL: http://www.onsemi.com/pub/Collateral/BZX84C2V4LT1-D.PDF
D402 D403 = Diode: SCHOTTKY 3A DIODE; Published: 8-Jun-2000; LatestRevisionDate: 17-Jul-2002; LatestRevisionNote: Re-released for DXP Platform.; PackageDocument: Sep-1996; PackageReference: SMC; Publisher: Altium Limited; Code_JEDEC: DO-214-AB
D404 = LED0: LED SML-311DTT86; Published: 8-Jun-2000; LatestRevisionDate: 08-Jul-2005; LatestRevisionNote: Mech Layer 1 removed.; PackageReference: LED-0; Publisher: Altium Limited
L401 L402 = Inductor: Code_IEC: 1005; Published: 8-Jun-2000; LatestRevisionDate: 17-Jul-2002; LatestRevisionNote: Re-released for DXP Platform.; PackageReference: 0402-A; Publisher: Altium Limited; Code_JEITA: 0402
P1-P7 P18 = Plug: LatestRevisionDate: 17-Jul-2002; LatestRevisionNote: Re-released for DXP Platform.; Publisher: Altium Limited
R401 R402 R404 R405 R407 R408 = Res2: Resistor; Published: 8-Jun-2000; LatestRevisionDate: 17-Jul-2002; LatestRevisionNote: Re-released for DXP Platform.; PackageReference: AXIAL-0.4; Publisher: Altium Limited
U401 = LM2830: High Frequency 1.0A Load - Step-Down DC-DC Regulator
U402 = LP38858: 1.5A Fast-Reponse High-Accuracy LDO Linear Regulator with Soft-Start

## Nets that join several sheets
+1V2: FPGA (9 pins), POWER_SUPPLY (C409.1 C410.2 P5.1 U402.4)
+3V3: CONNECTS (C101.1 U101.20), FPGA (38 pins), POWER_SUPPLY (9 pins)
+5V: CONNECTS (10 pins), POWER_SUPPLY (D402.2 L401.1 P1.1 R407.2)
GND: CONNECTS (20 pins), FPGA (43 pins), POWER_SUPPLY (19 pins)
FPGA_GPIO_0: CONNECTS (PORT1.13), FPGA (U301.41)
FPGA_GPIO_1: CONNECTS (PORT1.14), FPGA (U301.42)
FPGA_GPIO_2: CONNECTS (PORT1.15), FPGA (U301.43)
FPGA_GPIO_3: CONNECTS (PORT1.16), FPGA (U301.44)
FPGA_GPIO_4: CONNECTS (PORT1.17), FPGA (U301.45)
FPGA_GPIO_5: CONNECTS (PORT1.18), FPGA (U301.46)
FPGA_GPIO_6: CONNECTS (PORT1.19), FPGA (U301.47)
FPGA_GPIO_7: CONNECTS (PORT1.20), FPGA (U301.48)
FPGA_GPIO_8: CONNECTS (PORT1.21), FPGA (U301.49)
FPGA_GPIO_9: CONNECTS (PORT1.22), FPGA (U301.50)
FPGA_PHA1: CONNECTS (PORT1.37 U101.18), FPGA (U301.102)
FPGA_PHA2: CONNECTS (PORT1.35 U101.14), FPGA (U301.104)
FPGA_PHA3: CONNECTS (PORT1.33), FPGA (U301.101)
FPGA_PHA4: CONNECTS (PORT1.31), FPGA (U301.98)
FPGA_PHB1: CONNECTS (PORT1.38 U101.16), FPGA (U301.103)
FPGA_PHB2: CONNECTS (P19.1 PORT1.36 U101.12), FPGA (U301.105)
FPGA_PHB3: CONNECTS (PORT1.34), FPGA (U301.99)
FPGA_PHB4: CONNECTS (PORT1.32), FPGA (U301.96)
FPGA_SERVO_0: CONNECTS (PORT1.3), FPGA (U301.3)
FPGA_SERVO_1: CONNECTS (PORT1.4), FPGA (U301.4)
FPGA_SERVO_2: CONNECTS (PORT1.5), FPGA (U301.5)
FPGA_SERVO_3: CONNECTS (PORT1.6), FPGA (U301.6)
FPGA_SERVO_4: CONNECTS (PORT1.7), FPGA (U301.7)
FPGA_SERVO_5: CONNECTS (PORT1.8), FPGA (U301.8)
FPGA_SERVO_6: CONNECTS (PORT1.9), FPGA (U301.10)
FPGA_SERVO_7: CONNECTS (PORT1.10), FPGA (U301.11)
FPGA_SERVO_8: CONNECTS (PORT1.11), FPGA (U301.12)
FPGA_SERVO_9: CONNECTS (PORT1.12), FPGA (U301.13)